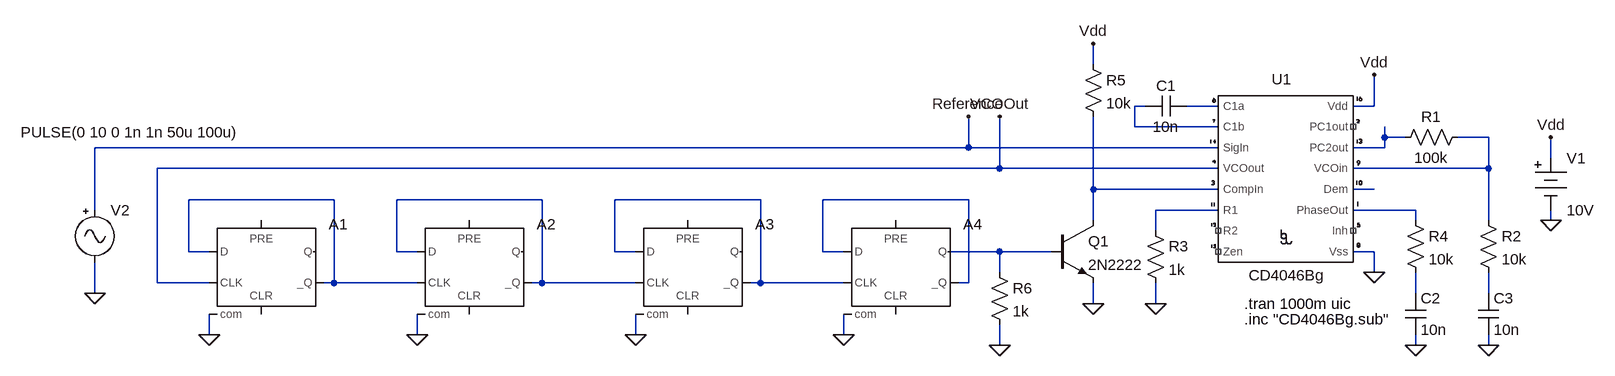
[diagram p0: schematic PLL_mult.asc]
PLL_mult.asc, the LTspice schematic file:
Version 4
SHEET 1 1208 680
WIRE 432 0 432 -32
WIRE 512 64 496 64
WIRE 624 64 576 64
WIRE 864 64 864 16
WIRE 864 64 832 64
WIRE 496 96 496 64
WIRE 624 96 496 96
WIRE 880 112 880 96
WIRE 912 112 880 112
WIRE 1040 112 992 112
WIRE 240 128 240 80
WIRE 240 128 -1104 128
WIRE 624 128 240 128
WIRE 880 128 880 112
WIRE 880 128 832 128
WIRE 1136 144 1136 112
WIRE 288 160 288 80
WIRE 288 160 -1008 160
WIRE 624 160 288 160
WIRE 1040 160 1040 112
WIRE 1040 160 832 160
WIRE 432 192 432 80
WIRE 624 192 432 192
WIRE 864 192 832 192
WIRE -736 208 -960 208
WIRE -416 208 -640 208
WIRE -80 208 -304 208
WIRE 240 208 16 208
WIRE -1104 224 -1104 128
WIRE 624 224 528 224
WIRE 928 224 832 224
WIRE 432 240 432 192
WIRE 928 240 928 224
WIRE 1040 240 1040 160
WIRE 1136 240 1136 224
WIRE 528 256 528 224
WIRE -960 288 -960 208
WIRE -928 288 -960 288
WIRE -640 288 -640 208
WIRE -608 288 -640 288
WIRE -304 288 -304 208
WIRE -272 288 -304 288
WIRE 16 288 16 208
WIRE 48 288 16 288
WIRE 288 288 208 288
WIRE 368 288 288 288
WIRE 864 288 832 288
WIRE 288 320 288 288
WIRE 864 320 864 288
WIRE -1008 336 -1008 160
WIRE -928 336 -1008 336
WIRE -736 336 -736 208
WIRE -736 336 -752 336
WIRE -608 336 -736 336
WIRE -416 336 -416 208
WIRE -416 336 -432 336
WIRE -272 336 -416 336
WIRE -80 336 -80 208
WIRE -80 336 -96 336
WIRE 48 336 -80 336
WIRE 240 336 240 208
WIRE 240 336 224 336
WIRE -1104 352 -1104 304
WIRE 928 352 928 320
WIRE 1040 352 1040 320
WIRE 432 368 432 336
WIRE 528 368 528 336
WIRE -928 416 -928 384
WIRE -608 416 -608 384
WIRE -272 416 -272 384
WIRE 48 416 48 384
WIRE 288 432 288 400
WIRE 928 432 928 416
WIRE 1040 432 1040 416
FLAG 1136 240 0
FLAG 1136 112 Vdd
FLAG 864 320 0
FLAG 864 16 Vdd
FLAG 1040 432 0
FLAG 528 368 0
FLAG -1104 352 0
FLAG 928 432 0
FLAG -928 416 0
FLAG 432 368 0
FLAG 432 -32 Vdd
FLAG -608 416 0
FLAG -272 416 0
FLAG 48 416 0
FLAG 288 432 0
FLAG 288 80 VCOOut
FLAG 240 80 Reference
SYMBOL CD4046Bg 736 208 R0
SYMATTR InstName U1
SYMBOL cap 512 80 R270
WINDOW 0 32 32 VTop 2
WINDOW 3 0 32 VBottom 2
SYMATTR InstName C1
SYMATTR Value 10n
SYMBOL Misc\\battery 1136 128 R0
WINDOW 123 0 0 Left 2
WINDOW 39 0 0 Left 2
SYMATTR InstName V1
SYMATTR Value 10V
SYMBOL res 512 240 R0
SYMATTR InstName R3
SYMATTR Value 1k
SYMBOL cap 1024 352 R0
SYMATTR InstName C3
SYMATTR Value 10n
SYMBOL Misc\\signal -1104 208 R0
WINDOW 3 -114 -104 Left 2
WINDOW 123 0 0 Left 2
WINDOW 39 0 0 Left 2
SYMATTR Value PULSE(0 10 0 1n 1n 50u 100u)
SYMATTR InstName V2
SYMBOL res 1008 96 R90
WINDOW 0 0 56 VBottom 2
WINDOW 3 32 56 VTop 2
SYMATTR InstName R1
SYMATTR Value 100k
SYMBOL res 1024 224 R0
SYMATTR InstName R2
SYMATTR Value 10k
SYMBOL res 912 224 R0
SYMATTR InstName R4
SYMATTR Value 10k
SYMBOL cap 912 352 R0
SYMATTR InstName C2
SYMATTR Value 10n
SYMBOL Digital\\dflop -848 240 R0
SYMATTR InstName A1
SYMBOL npn 368 240 R0
SYMATTR InstName Q1
SYMATTR Value 2N2222
SYMBOL res 416 -16 R0
SYMATTR InstName R5
SYMATTR Value 10k
SYMBOL Digital\\dflop -528 240 R0
SYMATTR InstName A2
SYMBOL Digital\\dflop -192 240 R0
SYMATTR InstName A3
SYMBOL Digital\\dflop 128 240 R0
SYMATTR InstName A4
SYMBOL res 272 304 R0
SYMATTR InstName R6
SYMATTR Value 1k
TEXT 664 368 Left 2 !.tran 1000m uic
TEXT 664 392 Left 2 !.inc "CD4046Bg.sub"

The netlist it stands for:
* PLL_mult.asc
XU1 N002 N001 N005 NC_01 N011 NC_02 Reference N004 Vdd 0 N006 NC_03 N003 N012 VCOOut NC_04 CD4046Bg  ; pins C1a C1b CompIn Inh R1 R2 SigIn VCOin Vdd Vss Dem PC1out PC2out PhaseOut VCOout Zen
C1 N001 N002 10n
V1 Vdd 0 10V
R3 N011 0 1k
C3 N015 0 10n
V2 Reference 0 PULSE(0 10 0 1n 1n 50u 100u)
R1 N004 N003 100k
R2 N004 N015 10k
R4 N012 N014 10k
C2 N014 0 10n
A1 N007 0 VCOOut 0 0 N007 0 0 DFLOP
Q1 N005 N013 0 0 2N2222
R5 Vdd N005 10k
A2 N008 0 N007 0 0 N008 0 0 DFLOP
A3 N009 0 N008 0 0 N009 0 0 DFLOP
A4 N010 0 N009 0 0 N010 N013 0 DFLOP
R6 N013 0 1k
.model NPN NPN
.model PNP PNP
.lib standard.bjt
.tran 1000m uic
.inc "CD4046Bg.sub"
.backanno
.end